# EAGLE schematic SmartStormDrainWiringDiagram (EAGLE 9.6.1)
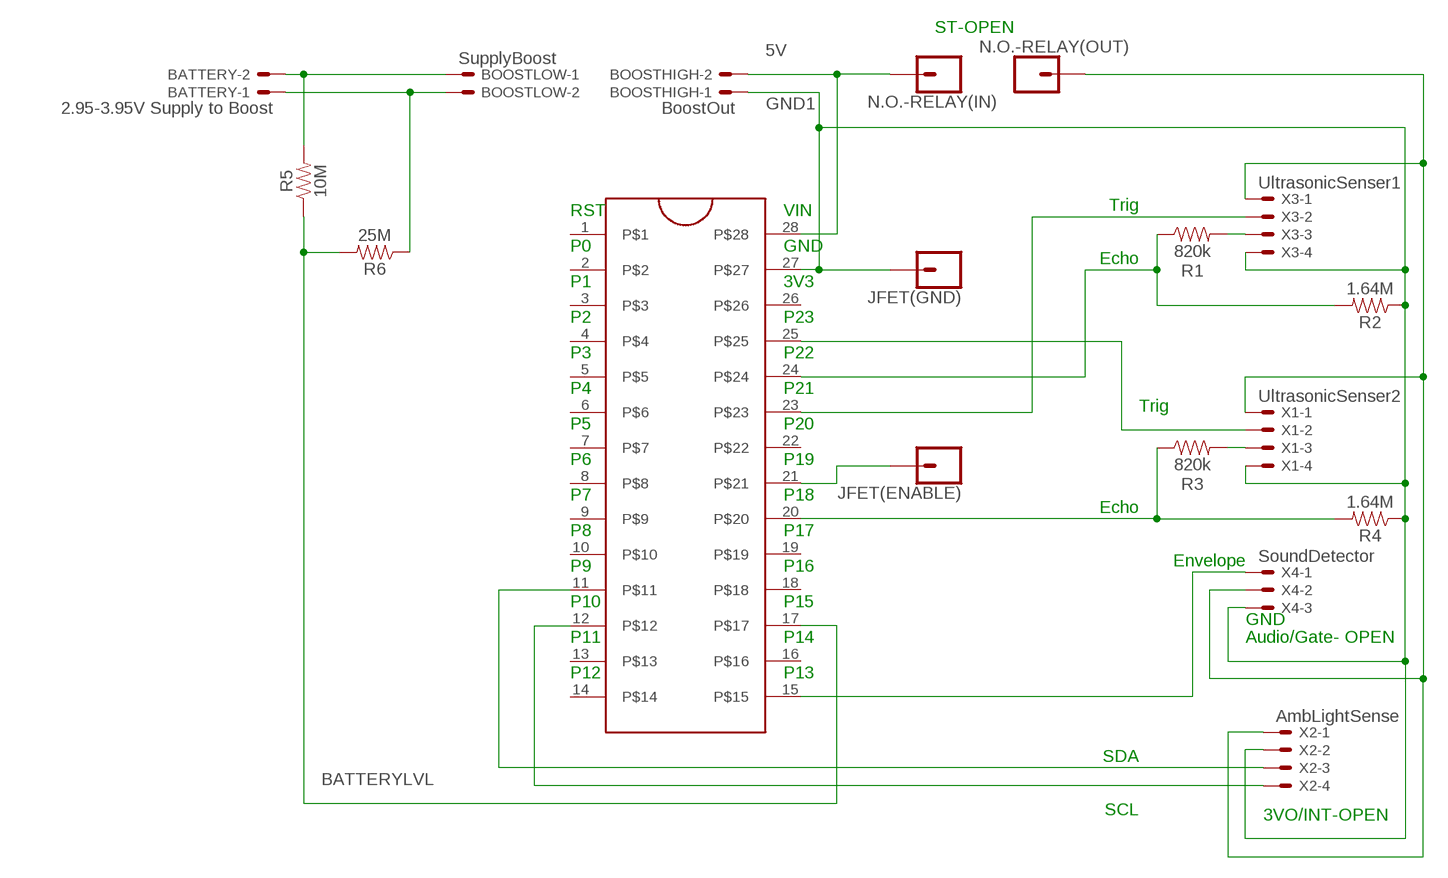
[diagram p0: schematic, sheet 1]

## Parts
BATTERY  2.95-3.95V Supply to Boost  22-23-2021  [22-23-2021]
BOOSTHIGH  BoostOut  22-23-2021  [22-23-2021]
BOOSTLOW  SupplyBoost  22-23-2021  [22-23-2021]
JFET(ENABLE)  CONN_01SMTSO-256-ET-0.165DIA  [SMTSO-256-ET-0.165DIA]
JFET(GND)  CONN_01SMTSO-256-ET-0.165DIA  [SMTSO-256-ET-0.165DIA]
LOPY4  LoPy4  ZIFSOCKET-28-3"  [DIL28-3-ZIF_SOCKET]
N.O.-RELAY(IN)  CONN_01SMTSO-256-ET-0.165DIA  [SMTSO-256-ET-0.165DIA]
N.O.-RELAY(OUT)  CONN_01SMTSO-256-ET-0.165DIA  [SMTSO-256-ET-0.165DIA]
R1  820k  1MOHM-0603-1/4W-5%  [0603]
R2  1.64M  1MOHM-0603-1/4W-5%  [0603]
R3  820k  1MOHM-0603-1/4W-5%  [0603]
R4  1.64M  1MOHM-0603-1/4W-5%  [0603]
R5  10M  1MOHM-0603-1/4W-5%  [0603]
R6  25M  1MOHM-0603-1/4W-5%  [0603]
X1  UltrasonicSenser2  22-23-2041  [22-23-2041]
X2  AmbLightSense  22-23-2041  [22-23-2041]
X3  UltrasonicSenser1  22-23-2041  [22-23-2041]
X4  SoundDetector  22-23-2031  [22-23-2031]

## Nets
5V: BOOSTHIGH.2 LOPY4.28 N.O.-RELAY(IN).P$1
5V+1: N.O.-RELAY(OUT).P$1 X1.1 X2.1 X3.1 X4.2
BATTERYLVL: LOPY4.17 R5.1 R6.2
GND1: BOOSTHIGH.1 JFET(GND).P$1 LOPY4.27 R2.1 R4.1 X1.4 X2.2 X3.4 X4.3
N$1: BATTERY.2 BOOSTLOW.1 R5.2
N$2: BATTERY.1 BOOSTLOW.2 R6.1
N$3: LOPY4.25 X1.2
N$4: R3.2 X1.3
N$5: LOPY4.20 R3.1 R4.2
N$6: LOPY4.15 X4.1
N$7: LOPY4.23 X3.2
N$8: R1.2 X3.3
N$9: JFET(ENABLE).P$1 LOPY4.21
N$11: LOPY4.12 X2.4
N$14: LOPY4.11 X2.3
N$16: LOPY4.24 R1.1 R2.2
Unconnected: LOPY4.1 LOPY4.2 LOPY4.3 LOPY4.4 LOPY4.5 LOPY4.6 LOPY4.7 LOPY4.8 LOPY4.9 LOPY4.10 LOPY4.13 LOPY4.14 LOPY4.16 LOPY4.18 LOPY4.19 LOPY4.22 LOPY4.26

## Notes on the sheet
- ST-OPEN
- Trig
- RST | VIN
- P0 | GND | Echo
- P1 | 3V3
- P2 | P23
- P3 | P22
- P4 | P21
- Trig
- P5 | P20
- P6 | P19
- P7 | P18 | Echo
- P8 | P17
- Envelope
- P9 | P16
- P10 | P15
- GND
- P11 | P14 | Audio/Gate- OPEN
- P12 | P13
- SDA
- SCL
- 3VO/INT-OPEN

## Library data of the parts
BATTERY BOOSTHIGH BOOSTLOW = con-molex:22-23-2021: .100" (2.54mm) Center Header - 2 Pin; MF: MOLEX; MPN: 22-23-2021; OC_FARNELL: 1462926; OC_NEWARK: 25C3832
JFET(ENABLE) JFET(GND) N.O.-RELAY(IN) N.O.-RELAY(OUT) = SparkFun-Connectors:CONN_01: Single connection point. Often used as Generic Header-pin footprint for 0.1 inch spaced/style header connections On any of the 0.1 inch spaced packages, you can populate with these: Break Away Headers - Straight <https://www.sparkfun.com/products/116> (PRT-00116) Break Away Male Headers - Right Angle <https://www.sparkfun.com/products/553> (PRT-00553) Female Headers <https://www.sparkfun.com/products/115> (PRT-00115) Break Away Headers - Machine Pin <https://www.sparkfun.com/products/117> (PRT-00117) Break Away Female Headers - Swiss Machine Pin <https://www.sparkfun.com/products/743> (PRT-00743) This device is also useful as a general connection point to wire up your design to another part of your project. Our various solder wires solder well into these plated through hole pads. Hook-Up Wire - Assortment (Stranded, 22 AWG) <https://www.sparkfun.com/products/11375> (PRT-11375) Hook-Up Wire - Assortment (Solid Core, 22 AWG) <https://www.sparkfun.com/products/11367> (PRT-11367) View the entire wire category on our website here <https://www.sparkfun.com/categories/141> Special notes: SMTSO-256-ET is a "flush mount" nut for a 4-40 screw. We mostly use this on specialty testbeds; it is a nice way to connect hardware to your PCB at an adjustable hieght. Also note, the SNAP packages are for using a snappable style connector. We sell a baggie of snaps and they are also used on two LilyPad designs: Snap Assortment - 30 pack (male and female) <https://www.sparkfun.com/products/11347> (DEV-11347) LilyPad Arduino SimpleSnap <https://www.sparkfun.com/products/10941> (DEV-10941) LilyPad SimpleSnap Protoboard <https://www.sparkfun.com/products/10940> (DEV-10940); PROD_ID: HW-08694
LOPY4 = SparkFun-Connectors:ZIFSOCKET-28-3: ZIF Socket 28-Pin 0.3" Lever-action ZIF socket for 28-pin ICs SparkFun Products: ZIF Socket 28-Pin <https://www.sparkfun.com/products/9175>; PROD_ID: CONN-10960; SF_ID: PRT-09175
R1-R6 = SparkFun-Resistors:1MOHM: 1MΩ resistor A resistor is a passive two-terminal electrical component that implements electrical resistance as a circuit element. Resistors act to reduce current flow, and, at the same time, act to lower voltage levels within circuits. - Wikipedia; PROD_ID: RES-07868; VALUE: 1M
X1-X3 = con-molex:22-23-2041: .100" (2.54mm) Center Header - 4 Pin; MF: MOLEX; MPN: 22-23-2041; OC_FARNELL: 1462920; OC_NEWARK: 38C0355
X4 = con-molex:22-23-2031: .100" (2.54mm) Center Header - 3 Pin; MF: MOLEX; MPN: 22-23-2031; OC_FARNELL: 1462950; OC_NEWARK: 30C0862